# EAGLE design SpringReverbFront (EAGLE 7.2.0)

## Sheet 1 of 2: Power
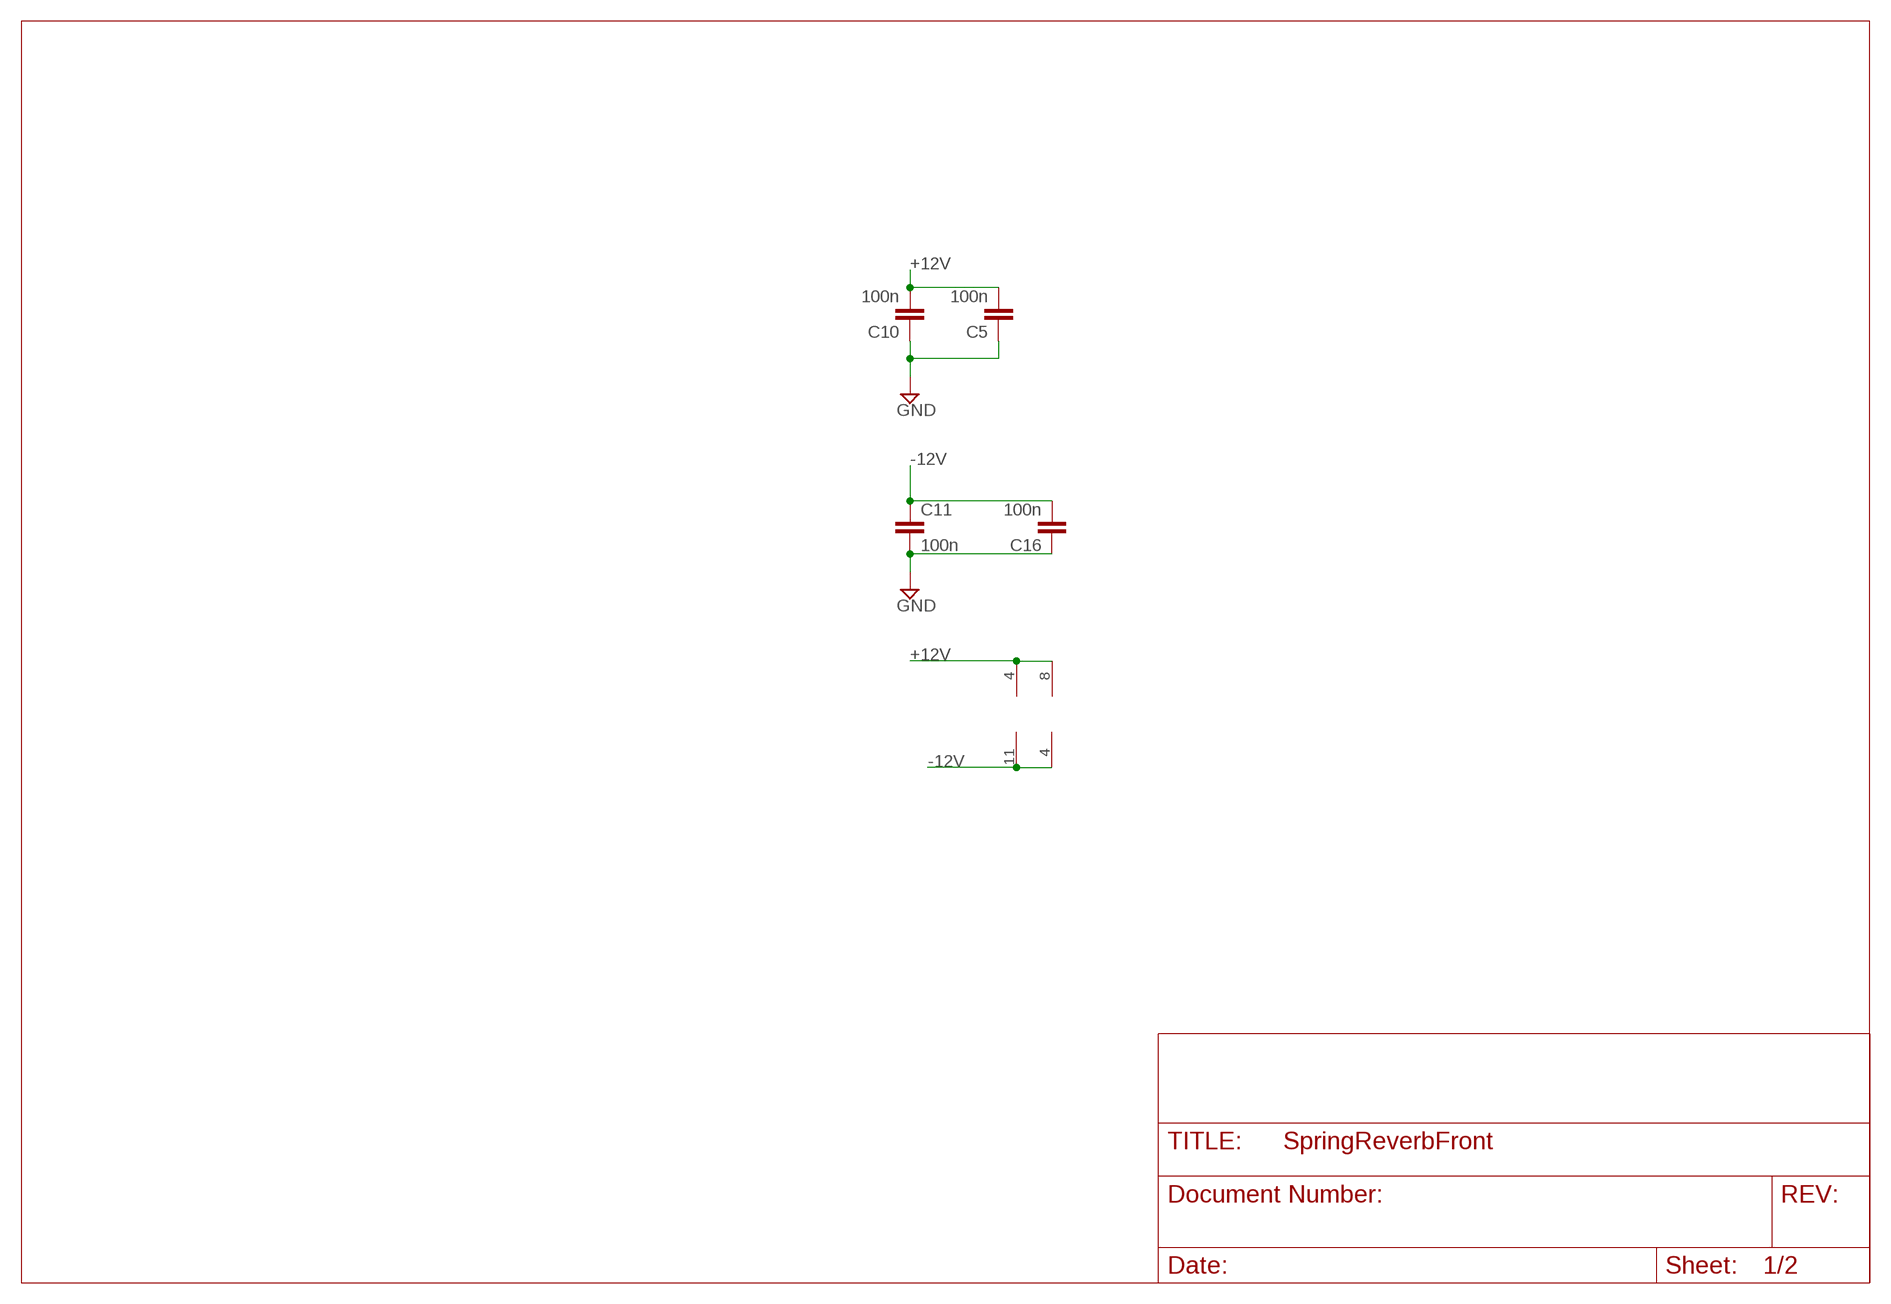
[diagram p0: schematic, sheet 1]

### Parts
C5  100n  C-EU050-024X044  [C050-024X044]
C10  100n  C-EU050-024X044  [C050-024X044]
C11  100n  C-EU050-024X044  [C050-024X044]
C16  100n  C-EU050-024X044  [C050-024X044]
IC1  TL074  TL074P  [DIL14]
IC2_EQ  NE5532  TL072P  [DIL08]

### Nets
+12V [power]: C5.2 C10.2 IC1.4(P:V+) IC2_EQ.8(P:V+) ; also sheet 2
-12V [power]: C11.1 C16.2 IC1.11(P:V-) IC2_EQ.4(P:V-) ; also sheet 2
GND [ground]: C5.1 C10.1 C11.2 C16.1 ; also sheet 2

## Sheet 2 of 2
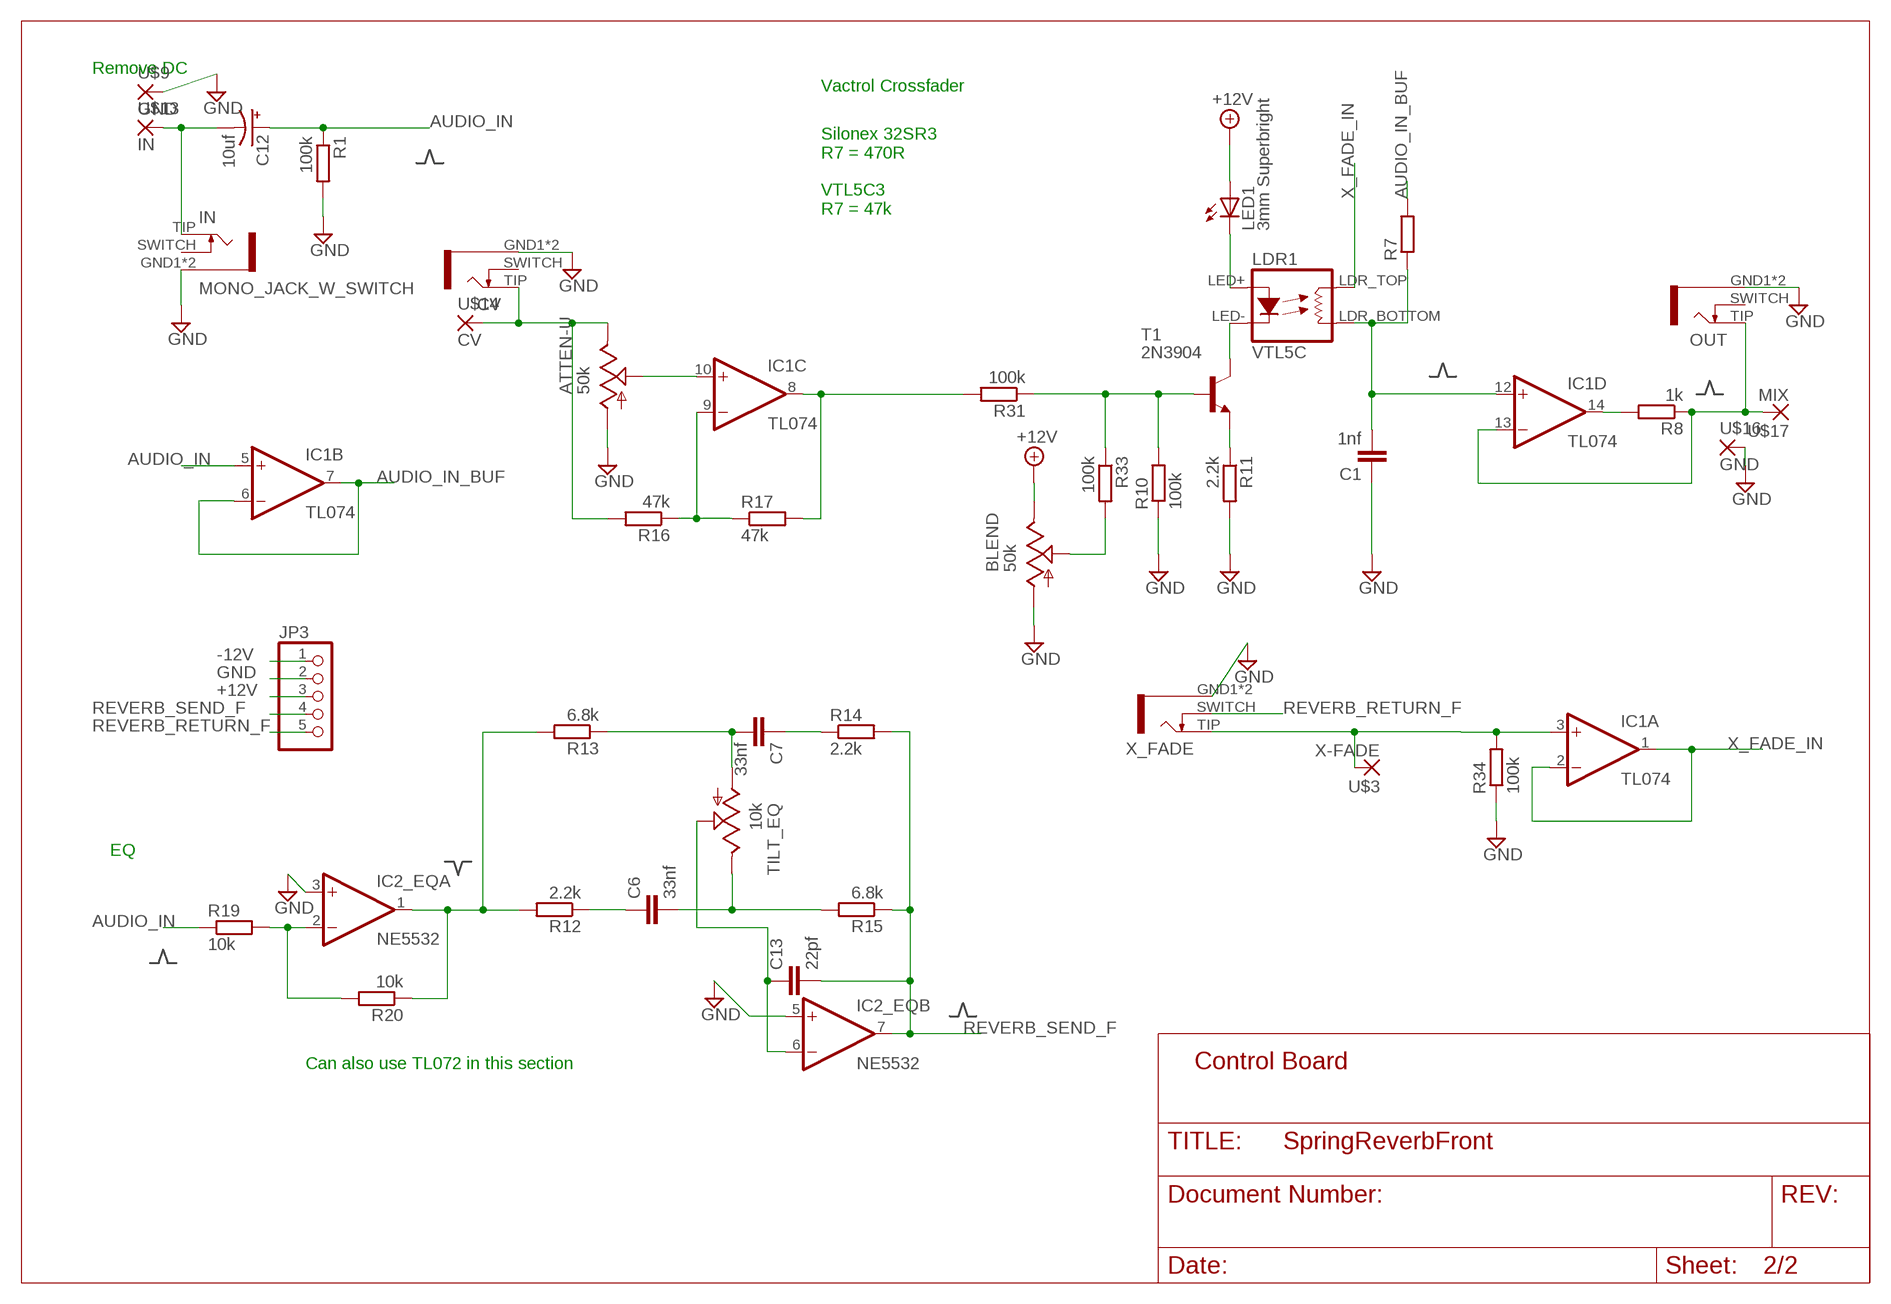
[diagram p1: schematic, sheet 2]

### Parts
ATTEN-U  50k  ALPHA-9MMF2A  [EVUF]
BLEND  50k  ALPHA-9MMF2A  [EVUF]
C1  1nf  C-EU050-024X044  [C050-024X044]
C6  33nf  C-EU050-024X044  [C050-024X044]
C7  33nf  C-EU050-024X044  [C050-024X044]
C12  10uf  050  [050_020]
C13  22pf  050X030_0251  [050X030_025]
CV  MONO_JACK_W_SWITCH  [ERTHENVAR]
IN  MONO_JACK_W_SWITCH  [ERTHENVAR]
JP3  PINHD-1X5  [1X05]
LDR1  VTL5C  VACTROL_COMPACT  [VACTROL_COMPACT]
LED1  3mm Superbright  LED3MM  [LED3MM]
OUT  MONO_JACK_W_SWITCH  [ERTHENVAR]
R1  100k  VERT-RESIST1  [VERT-RESISTOR]
R7  R-EU_STANDARD_RESISTOR  [0207/10]
R8  1k  R-EU_STANDARD_RESISTOR  [0207/10]
R10  100k  R-EU_STANDARD_RESISTOR  [0207/10]
R11  2.2k  R-EU_STANDARD_RESISTOR  [0207/10]
R12  2.2k  R-EU_STANDARD_RESISTOR  [0207/10]
R13  6.8k  R-EU_STANDARD_RESISTOR  [0207/10]
R14  2.2k  R-EU_STANDARD_RESISTOR  [0207/10]
R15  6.8k  R-EU_STANDARD_RESISTOR  [0207/10]
R16  47k  VERT-RESIST1  [VERT-RESISTOR]
R17  47k  VERT-RESIST1  [VERT-RESISTOR]
R19  10k  VERT-RESIST1  [VERT-RESISTOR]
R20  10k  R-EU_STANDARD_RESISTOR  [0207/10]
R31  100k  R-EU_STANDARD_RESISTOR  [0207/10]
R33  100k  R-EU_STANDARD_RESISTOR  [0207/10]
R34  100k  R-EU_STANDARD_RESISTOR  [0207/10]
T1  2N3904  [TO92]
TILT_EQ  10k  ALPHA-9MMF2A  [EVUF]
U$3  X-FADE  LONG_PAD_1  [LONG_PAD_1]
U$9  GND  LONG_PAD_1  [LONG_PAD_1]
U$13  IN  LONG_PAD_1  [LONG_PAD_1]
U$14  CV  LONG_PAD_1  [LONG_PAD_1]
U$16  GND  LONG_PAD_1  [LONG_PAD_1]
U$17  MIX  LONG_PAD_1  [LONG_PAD_1]
X_FADE  MONO_JACK_W_SWITCH  [ERTHENVAR]

### Nets
+12V [power]: BLEND.3(E) JP3.3 LED1.A ; also sheet 1
-12V [power]: JP3.1 ; also sheet 1
AUDIO_IN: C12.+ IC1.5(B:+IN) R1.1 R19.1
AUDIO_IN_BUF: IC1.6(B:-IN) IC1.7(B:OUT) R7.2
GND [ground]: ATTEN-U.1(A) BLEND.1(A) C1.1 CV.GND1(SLEEVE) CV.GND2(SLEEVE) IC2_EQ.3(A:+IN) IC2_EQ.5(B:+IN) IN.GND1(SLEEVE) IN.GND2(SLEEVE) JP3.2 OUT.GND1(SLEEVE) OUT.GND2(SLEEVE) R1.2 R10.1 R11.2 R34.1 U$9.P$1(P) U$16.P$1(P) X_FADE.GND1(SLEEVE) X_FADE.GND2(SLEEVE) ; also sheet 1
MIX_OUT_B: IC1.13(D:-IN) OUT.TIP R8.1 U$17.P$1(P)
N$1: C12.- IN.TIP U$13.P$1(P)
N$3: IC1.3(A:+IN) R34.2 U$3.P$1(P) X_FADE.TIP
N$10: ATTEN-U.3(E) CV.TIP R16.2 U$14.P$1(P)
N$13: C6.1 R12.1
N$14: BLEND.2(S) R33.2
N$15: IC1.14(D:OUT) R8.2
N$16: C6.2 R15.2 TILT_EQ.3(E)
N$17: R11.1 T1.3(E)
N$18: C7.2 R13.1 TILT_EQ.1(A)
N$20: ATTEN-U.2(S) IC1.10(C:+IN)
N$21: C7.1 R14.1
N$22: C13.1 IC2_EQ.6(B:-IN) TILT_EQ.2(S)
N$23: IC1.9(C:-IN) R16.1 R17.1
N$24: IC2_EQ.2(A:-IN) R19.2 R20.2
N$25: IC1.8(C:OUT) R17.2 R31.2
N$26: LDR1.LED+ LED1.K(C)
N$31: IC2_EQ.1(A:OUT) R12.2 R13.2 R20.1
N$36: R10.2 R31.1 R33.1 T1.2(B)
N$37: LDR1.LED- T1.1(C)
REVERB_RETURN_F: JP3.5 X_FADE.SWITCH
REVERB_SEND_F: C13.2 IC2_EQ.7(B:OUT) JP3.4 R14.2 R15.1
SUM: C1.2 IC1.12(D:+IN) LDR1.LDR_BOTTOM(RES2) R7.1
X_FADE_IN: IC1.1(A:OUT) IC1.2(A:-IN) LDR1.LDR_TOP(RES1)
Unconnected: CV.SWITCH IN.SWITCH OUT.SWITCH

### Notes on the sheet
- Remove DC
- Vactrol Crossfader
- Silonex 32SR3 
  R7 = 470R
  
  VTL5C3 
  R7 = 47k
- EQ
- Can also use TL072 in this section | Control Board

## Library data of the parts
ATTEN-U BLEND TILT_EQ = TomW:ALPHA-9MM: 9 mm Square Rotary Potentiometers Source: Panasonic
C1 C5-C7 C10 C11 C16 = TomW:C-EU: CAPACITOR, European symbol
C12 = gm-caps-electro-pol:050: 0.22 - 100uF Xicon values at Mouser.com: 10V: 10 - 100uF; 16V: 2.2 - 47uF; 25V: 0.47 - 47uF; 50V: 0.22 - 22uF
C13 = gm-caps-ceramic:050X030_025: 47 - 120pF Xicon Ceramic Disc 2.5mm lead spacing
CV IN OUT X_FADE = erthenvar:MONO_JACK_W_SWITCH
IC1 = linear:TL074: OP AMP
IC2_EQ = TomW:TL072: OP AMP
JP3 = pinhead:PINHD-1X5: PIN HEADER
LDR1 = TomW:VACTROL_COMPACT
LED1 = TomW:LED: LED OSRAM: - CHIPLED LG R971, LG N971, LY N971, LG Q971, LY Q971, LO R971, LY R971 LH N974, LH R974 LS Q976, LO Q976, LY Q976 LO Q996 - Hyper CHIPLED LW Q18S LB Q993, LB Q99A, LB R99A - SideLED LS A670, LO A670, LY A670, LG A670, LP A670 LB A673, LV A673, LT A673, LW A673 LH A674 LY A675 LS A676, LA A676, LO A676, LY A676, LW A676 LS A679, LY A679, LG A679 - Hyper Micro SIDELED® LS Y876, LA Y876, LO Y876, LY Y876 LT Y87S - SmartLED LW L88C, LW L88S LB L89C, LB L89S, LG L890 LS L89K, LO L89K, LY L89K LS L896, LA L896, LO L896, LY L896 - TOPLED LS T670, LO T670, LY T670, LG T670, LP T670 LSG T670, LSP T670, LSY T670, LOP T670, LYG T670 LG T671, LOG T671, LSG T671 LB T673, LV T673, LT T673, LW T673 LH T674 LS T676, LA T676, LO T676, LY T676, LB T676, LH T676, LSB T676, LW T676 LB T67C, LV T67C, LT T67C, LS T67K, LO T67K, LY T67K, LW E67C LS E67B, LA E67B, LO E67B, LY E67B, LB E67C, LV E67C, LT E67C LW T67C LS T679, LY T679, LG T679 LS T770, LO T770, LY T770, LG T770, LP T770 LB T773, LV T773, LT T773, LW T773 LH T774 LS E675, LA E675, LY E675, LS T675 LS T776, LA T776, LO T776, LY T776, LB T776 LHGB T686 LT T68C, LB T68C - Hyper Mini TOPLED® LB M676 - Mini TOPLED Santana® LG M470 LS M47K, LO M47K, LY M47K Source: http://www.osram.convergy.de LUXEON: - LUMILED® LXK2-PW12-R00, LXK2-PW12-S00, LXK2-PW14-U00, LXK2-PW14-V00 LXK2-PM12-R00, LXK2-PM12-S00, LXK2-PM14-U00 LXK2-PE12-Q00, LXK2-PE12-R00, LXK2-PE12-S00, LXK2-PE14-T00, LXK2-PE14-U00 LXK2-PB12-K00, LXK2-PB12-L00, LXK2-PB12-M00, LXK2-PB14-N00, LXK2-PB14-P00, LXK2-PB14-Q00 LXK2-PR12-L00, LXK2-PR12-M00, LXK2-PR14-Q00, LXK2-PR14-R00 LXK2-PD12-Q00, LXK2-PD12-R00, LXK2-PD12-S00 LXK2-PH12-R00, LXK2-PH12-S00 LXK2-PL12-P00, LXK2-PL12-Q00, LXK2-PL12-R00 Source: www.luxeon.com KINGBRIGHT: KA-3528ASYC Source: www.kingbright.com
R1 R16 R17 R19 = TomW:VERT-RESIST1: Vertical resistor
R7 R8 R10-R15 R20 R31 R33 R34 = TomW:R-EU_: RESISTOR, European symbol
T1 = transistor:2N3904: NPN TRANSISTOR
U$3 U$9 U$13 U$14 U$16 U$17 = TomW:LONG_PAD_1

## Net classes
0 default: width 0.406 mm
1 power: width 0.61 mm
2 ground: width 0.61 mm

## Board
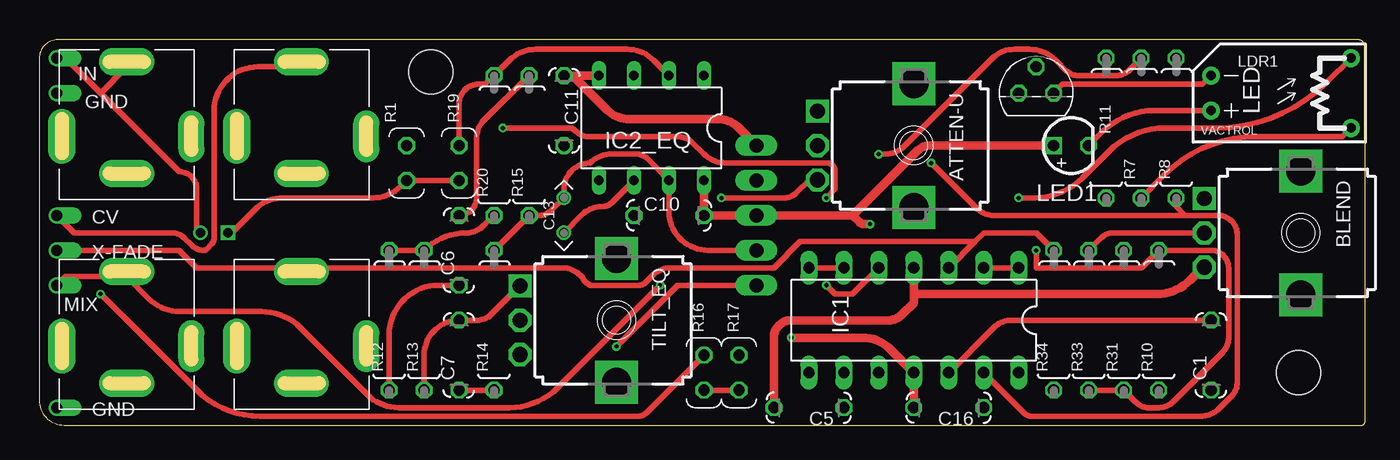
[diagram p2: board, top side]
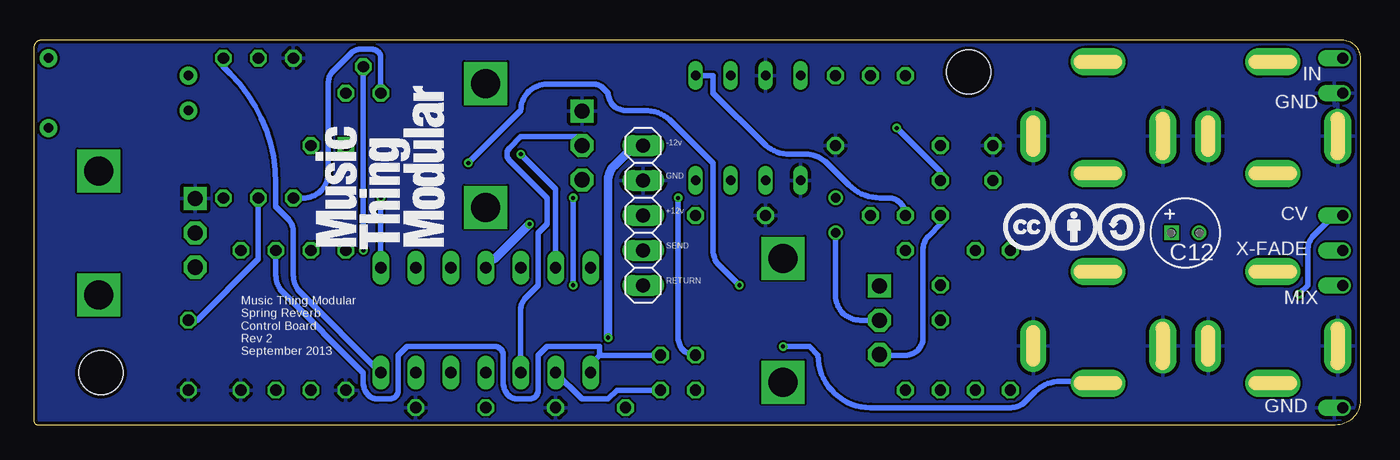
[diagram p3: board, bottom side, seen from below]

Size 96.27 x 28 mm. Coordinates in mm from the lower left corner, seen from the top.
Outline: 1.8,0 96.02,0 arc90 96.27,0.25 96.27,27.48 arc90 95.75,28 1.33,28 arc90 0,26.67 0,1.8 arc90 1.8,0
Copper layers (1*2*15*16): Top 0.035mm / dielectric 0.2mm / Route2 0.0175mm / dielectric 1.1mm / Route15 0.0175mm / dielectric 0.2mm / Bottom 0.035mm
Design rules "SeeedStudio_DRU_no_angle_20130527 *": minimum track width 6mil, minimum drill 12mil, track to track 6mil, track to pad 6mil, pad to pad 6mil, via to via 6mil, smd to smd 0mil, copper to edge 10mil, drill to drill 10mil, minimum pad ring 6mil, minimum via ring 6mil, stop-mask expansion 2mil, vias tented up to drill 25mil, thermal gap 10mil
Holes 3.2 mm at 91.44,3.81 28.45,25.65

### Footprints (pad centres in the part's own frame; a part is rotated, then mirrored left to right if it is on the bottom)
EVUF = drill 1.1 pad 1.676 square: 1 -2.5,-7 | drill 1.1 pad 1.676 octagon: 2 0,-7; 3 2.5,-7 | drill 2.1 pad 2.8 square: M1 4.5,0; M2 -4.5,0
C050-024X044 = drill 0.813 octagon: 1 -2.54,0; 2 2.54,0
050_020 = drill 0.7 square: + -1,0 | drill 0.7: - 1,0
050X030_025 = drill 0.7: 1 -1.27,0; 2 1.27,0
ERTHENVAR = drill 0.5 pad 2 long: GND1 -4.7,-0.6; SWITCH 0,-3.3; TIP 0,4.8 | drill 0.5 pad 1.9 long: GND2 4.7,-0.6
DIL14 = drill 0.813 long: 1 -7.62,-3.81; 2 -5.08,-3.81; 3 -2.54,-3.81; 4 0,-3.81; 5 2.54,-3.81; 6 5.08,-3.81; 7 7.62,-3.81; 8 7.62,3.81; 9 5.08,3.81; 10 2.54,3.81; 11 0,3.81; 12 -2.54,3.81; 13 -5.08,3.81; 14 -7.62,3.81
DIL08 = drill 0.7 long: 1 -3.81,-3.81; 2 -1.27,-3.81; 3 1.27,-3.81; 4 3.81,-3.81; 5 3.81,3.81; 6 1.27,3.81; 7 -1.27,3.81; 8 -3.81,3.81
1X05 = drill 1.016 long: 1 -5.08,0; 2 -2.54,0; 3 0,0; 4 2.54,0; 5 5.08,0
VACTROL_COMPACT = drill 0.7 pad 1.3: LDR_BOTTOM 5.08,-2.54; LDR_TOP 5.08,2.54; LED+ -5.08,-1.27; LED- -5.08,1.27
LED3MM = drill 0.813 square: A -1.27,0 | drill 0.813 octagon: K 1.27,0
VERT-RESISTOR = drill 0.813 octagon: 1 -1.27,0; 2 1.27,0
0207/10 = drill 0.813 octagon: 1 -5.08,0; 2 5.08,0
TO92 = drill 0.813 octagon: 1 1.27,0; 2 0,1.905; 3 -1.27,0
LONG_PAD_1 = drill 0.8 offset: P$1 0,0

### Placement (x,y rotation side)
ATTEN-U  63.5,20.32 270 top
BLEND  91.6,13.97 270 top
C1  85.09,5.08 90 top
C5  55.88,1.27 180 top
C6  30.48,12.7 90 top
C7  30.48,5.08 90 top
C10  45.72,15.24 0 top
C11  38.1,22.86 270 top
C12  12.7,13.97 0 bottom
C13  38.1,15.24 90 top
C16  66.04,1.27 180 top
CV  19.05,21.59 0 top
IC1  63.5,7.62 180 top
IC2_EQ  44.45,21.59 180 top
IN  6.35,21.59 0 top
JP3  52.07,15.24 270 bottom
LDR1  90.17,24.13 0 top
LED1  74.93,20.32 0 top
OUT  6.35,6.35 0 top
R1  26.67,19.05 90 top
R7  80.01,21.59 90 top
R8  82.55,21.59 90 top
R10  81.28,7.62 90 top
R11  77.47,21.59 90 top
R12  25.4,7.62 90 top
R13  27.94,7.62 90 top
R14  33.02,7.62 90 top
R15  35.56,20.32 90 top
R16  48.26,3.81 90 top
R17  50.8,3.81 90 top
R19  30.48,19.05 90 top
R20  33.02,20.32 90 top
R31  78.74,7.62 90 top
R33  76.2,7.62 90 top
R34  73.66,7.62 90 top
T1  72.39,24.13 0 top
TILT_EQ  41.91,7.62 270 top
U$3  1.27,12.7 0 top
U$8  [CC_1CM_SCREENPRINT]  25.91,12.7 0 bottom
U$9  1.27,24.13 0 top
U$10  [MTM_1CM]  66.04,12.7 90 bottom
U$13  1.27,26.67 0 top
U$14  1.27,15.24 0 top
U$16  1.27,1.27 0 top
U$17  1.27,10.16 0 top
X_FADE  19.05,6.35 0 top

### Tracks (layer width: path | path; a pad name or v marks a point on that pad's centre or on a via)
+12V  (via drill 0.3)
  Top 0.61: IC2_EQ.8 C10.2 JP3.3 59.05,15.24 | 59.05,15.24 63.72,19.9 arc-45 64.72,20.32 LED1.A | C5.2 53.34,6.35 arc-90 54.61,7.62 61.7,7.62 arc45 62.6,7.99 63.5,8.89 63.5,9.53 | IC1.4 63.5,9.53 | 63.5,9.53 81.13,9.53 arc45 83.55,10.53 84.45,11.43 BLEND.3 | v60.33,14.61 59.95,14.61 arc-45 59.5,14.79 59.05,15.24
  Bottom 0.61: v60.33,14.61 62.87,12.06 63.5,12.06 IC1.4
-12V  (via drill 0.3)
  Top 0.61: C16.2 IC1.11 61.79,5.52 arc45 59.78,6.35 v54.61,6.35 | C11.1 38.73,25.4 | 38.73,25.4 IC2_EQ.4 | JP3.1 50.75,21.64 arc45 49.33,22.23 42.86,22.23 arc-45 41.24,22.9 38.73,25.4
  Bottom 0.61: v54.61,6.35 54.61,17.83 arc45 54.19,18.83 52.7,20.32 JP3.1
AUDIO_IN  (via drill 0.3)
  Top 0.406: C12.+ 13.97,13.97 15.68,15.68 arc-45 17.69,16.51 24.22,16.51 arc45 26.23,17.34 R1.1 R19.1 | IC1.5 59.05,9.53 57.78,9.53 v57.15,10.16 | v57.15,16.51 57.78,17.14 57.78,18.41 arc90 57.15,19.05 49.84,19.05 arc-45 48.22,19.72 47.41,20.54 arc45 46.4,20.95 39.96,20.95 arc-45 38.95,21.37 38.92,21.4 arc45 38.47,21.59 v33.66,21.59
  Bottom 0.406: v57.15,16.51 v57.15,10.16 | v33.66,21.59 30.48,18.41 R19.1
AUDIO_IN_BUF  (via drill 0.3)
  Top 0.406: IC1.6 IC1.7 | R7.2 79.11,25.77 arc-45 78.21,25.4 75.46,25.4 arc-45 74.56,25.77 73.81,26.52 arc45 71.91,27.3 70.8,27.3 arc45 69.18,26.63 62.79,20.24 arc-45 61.44,19.68 v60.96,19.68
  Bottom 0.406: v60.96,19.68 58.42,17.14 IC1.6
GND
  pour Bottom: -2.54,31.75 99.06,31.75 99.06,-5.08 -2.54,-2.54
MIX_OUT_B  (via drill 0.3)
  Top 0.406: U$17.P$1 1.91,10.79 6.35,10.79 | IC1.13 71.49,0.9 arc45 72.13,0.64 84.3,0.64 arc45 85.65,1.19 86.58,2.12 arc45 87,3.13 87,13.82 arc90 85.58,15.24 83.19,15.24 | 83.19,15.24 82.55,15.88 R8.1 | 6.35,10.79 7.96,9.19 arc45 10.21,8.26 16.1,8.26 arc-45 18.97,7.06 23.84,2.2 arc45 26.08,1.27 34.14,1.27 arc45 37.65,2.72 v45.09,10.16 | 83.19,15.24 69.32,15.24 arc-45 68.05,15.77 v64.77,19.05 | 6.35,10.79 OUT.TIP
  Bottom 0.406: v45.09,10.16 46.57,11.65 arc45 46.99,12.65 46.99,19.05 49.97,22.03 arc-45 51.98,22.86 53.34,22.86 arc90 54.61,24.13 54.98,24.5 arc-45 55.62,24.77 59.05,24.77 arc-90 60.96,22.86 v64.77,19.05
N$1
  Top 0.406: 4.45,24.13 1.91,26.67 U$13.P$1 | 4.45,24.13 10.16,18.41 arc-90 11.43,17.14 11.43,13.97 C12.- | 4.45,24.13 6.35,26.04 IN.TIP
N$3
  Top 0.406: 67.94,13.34 68.58,13.97 72.39,13.97 R34.2 | 67.94,13.34 IC1.3 | 19.05,11.43 37.95,11.43 arc-45 39.29,10.87 39.45,10.72 arc45 40.03,10.16 43.55,10.16 arc45 44,10.35 44.53,10.87 arc-45 45.87,11.43 53.34,11.43 55.24,13.34 67.94,13.34 | U$3.P$1 10.16,12.7 11.43,11.43 19.05,11.43 | 19.05,11.43 X_FADE.TIP
N$10  (via drill 0.3)
  Top 0.406: v49.53,16.51 54.08,16.51 arc45 54.98,16.88 55.88,17.78 ATTEN-U.3 | U$14.P$1 2.54,13.97 9.63,13.97 arc-45 10.53,13.6 11.06,13.07 arc45 11.96,12.7 arc45 12.14,12.78 12.51,13.15 arc45 12.7,13.6 12.7,22.86 arc-90 15.88,26.04 19.05,26.04 CV.TIP | v4.45,9.53 11.42,2.55 arc45 16.04,0.64 43.44,0.64 arc45 44.08,0.9 R16.2
  Bottom 0.406: v49.53,16.51 49.53,6.35 arc-90 R16.2 | v4.45,9.53 3.81,10.16 3.81,12.75 arc45 3.39,13.75 1.91,15.24 U$14.P$1
N$13
  Top 0.406: C6.1 28.99,10.16 arc90 25.4,6.57 R12.1
N$14
  Top 0.406: BLEND.2 78,13.97 arc45 77.1,13.6 R33.2
N$15
  Bottom 0.406: IC1.14 76.94,9.63 arc45 77.47,10.9 77.47,14.02 arc-45 77.89,15.02 78.74,15.88 78.74,17.54 arc-45 82.05,25.54 82.55,26.04 R8.2
N$16
  Top 0.406: C6.2 arc90 31.75,16.51 31.75,20.85 arc-45 32.28,22.12 R15.2
  Bottom 0.406: C6.2 30.48,14.61 31.33,13.75 arc-45 31.75,12.75 31.75,6.35 arc90 33.02,5.08 34.29,5.08 TILT_EQ.3
N$17
  Bottom 0.406: R11.1 76.73,16.51 arc-90 74.93,18.31 74.93,24.87 arc45 74.56,25.77 73.29,27.04 arc45 72.65,27.3 71.75,27.3 arc90 71.12,26.67 T1.3
N$18
  Top 0.406: R13.1 27.94,5.08 arc-90 C7.2 31.8,7.62 arc45 32.8,8.04 34.29,9.53 TILT_EQ.1
N$20
  Bottom 0.406: IC1.10 60.96,8.36 arc45 60.59,9.26 59.69,10.16 59.69,13.97 59.05,14.61 59.05,16.51 61.78,19.24 arc90 61.78,20.13 60.96,20.95 56.52,20.95 56.52,20.32 ATTEN-U.2
N$21
  Top 0.406: R14.1 C7.1
N$22
  Top 0.406: C13.1 39.42,15.29 arc-45 40.84,15.88 40.9,15.88 arc45 41.54,16.14 IC2_EQ.6
  Bottom 0.406: C13.1 38.1,9.42 arc-90 36.3,7.62 TILT_EQ.2
N$23
  Top 0.406: R17.1 R16.1
  Bottom 0.406: IC1.9 56.52,1.91 54.61,1.91 53.98,2.54 R17.1
N$24
  Top 0.406: IC2_EQ.2 44.6,26.52 arc45 42.7,27.3 36.04,27.3 arc45 34.14,26.52 R20.2 32.38,24.77 31.9,24.77 arc90 30.48,23.34 R19.2
N$25
  Bottom 0.406: 55.24,5.08 R17.2 | 55.24,5.08 55.88,4.45 IC1.8 | R31.2 78.74,10.9 arc-45 78.21,9.63 72.39,3.81 72.39,3.07 arc-45 72.02,2.17 arc-45 71.38,1.91 70.48,1.91 arc-90 69.85,2.54 69.85,5.08 69.22,5.71 62.87,5.71 arc90 62.23,5.08 62.23,3.07 arc-45 61.86,2.17 arc-45 61.22,1.91 60.33,1.91 arc-90 59.69,2.54 59.69,5.08 59.05,5.71 55.24,5.71 55.24,5.08
N$26
  Top 0.406: LDR1.LED+ 80.97,22.86 arc45 77.16,21.28 LED1.K
N$31
  Top 0.406: R12.2 R13.2 arc-45 31.01,13.97 arc45 32.28,14.5 R20.1
  Bottom 0.406: IC2_EQ.1 46.99,25.4 46.99,24.13 43.33,20.47 arc-45 41.43,19.68 40.32,19.68 arc45 38.7,19.01 37.12,17.44 arc-45 34.88,16.51 34.29,16.51 arc90 R20.1
N$36  (via drill 0.3)
  Top 0.406: R33.1 R31.1 79.64,1.64 arc45 80.54,1.27 81.33,1.27 arc45 82.33,1.69 85.94,5.3 arc45 86.36,6.3 86.36,11.43 arc90 85.09,12.7 R10.2 80.01,11.43 72.39,11.43 v72.39,12.7
  Bottom 0.406: v72.39,12.7 T1.2
N$37
  Top 0.406: T1.1 74.3,24.77 84.45,24.77 LDR1.LED-
REVERB_RETURN_F  (via drill 0.3)
  Top 0.406: v41.91,5.71 46.35,10.16 JP3.5
  Bottom 0.406: v41.91,5.71 40.01,5.71 39.37,5.08 arc-90 35.56,1.27 25.35,1.27 arc-45 24.35,1.69 23.63,2.41 arc45 21.78,3.17 19.05,3.17 X_FADE.SWITCH
REVERB_SEND_F
  Top 0.406: R14.2 R15.1 36.3,15.24 arc45 37.2,15.61 C13.2 38.1,17.14 arc-90 40.01,19.05 arc-45 41.54,19.68 43.44,19.68 arc-45 44.08,19.42 IC2_EQ.7 45.72,15.54 arc90 48.56,12.7 JP3.4
SUM
  Top 0.406: C1.2 70.59,7.62 arc45 69.32,7.09 IC1.12 | LDR1.LDR_BOTTOM 94.61,20.95 88.34,20.95 arc45 81.71,18.21 R7.1
  Bottom 0.406: R7.1 80.01,12.06 84.45,7.62 C1.2
X_FADE_IN  (via drill 0.3)
  Top 0.406: IC1.1 IC1.2 | LDR1.LDR_TOP 93.5,24.92 arc-45 85.47,21.59 81.8,21.59 arc45 77.66,19.88 75.75,17.96 arc-45 72.24,16.51 v71.12,16.51
  Bottom 0.406: IC1.1 v71.12,16.51

### Text on the board
bPlace: -12v | GND | +12v | SEND | RETURN | Music Thing Modular / Spring Reverb / Control Board / Rev 2 / September 2013